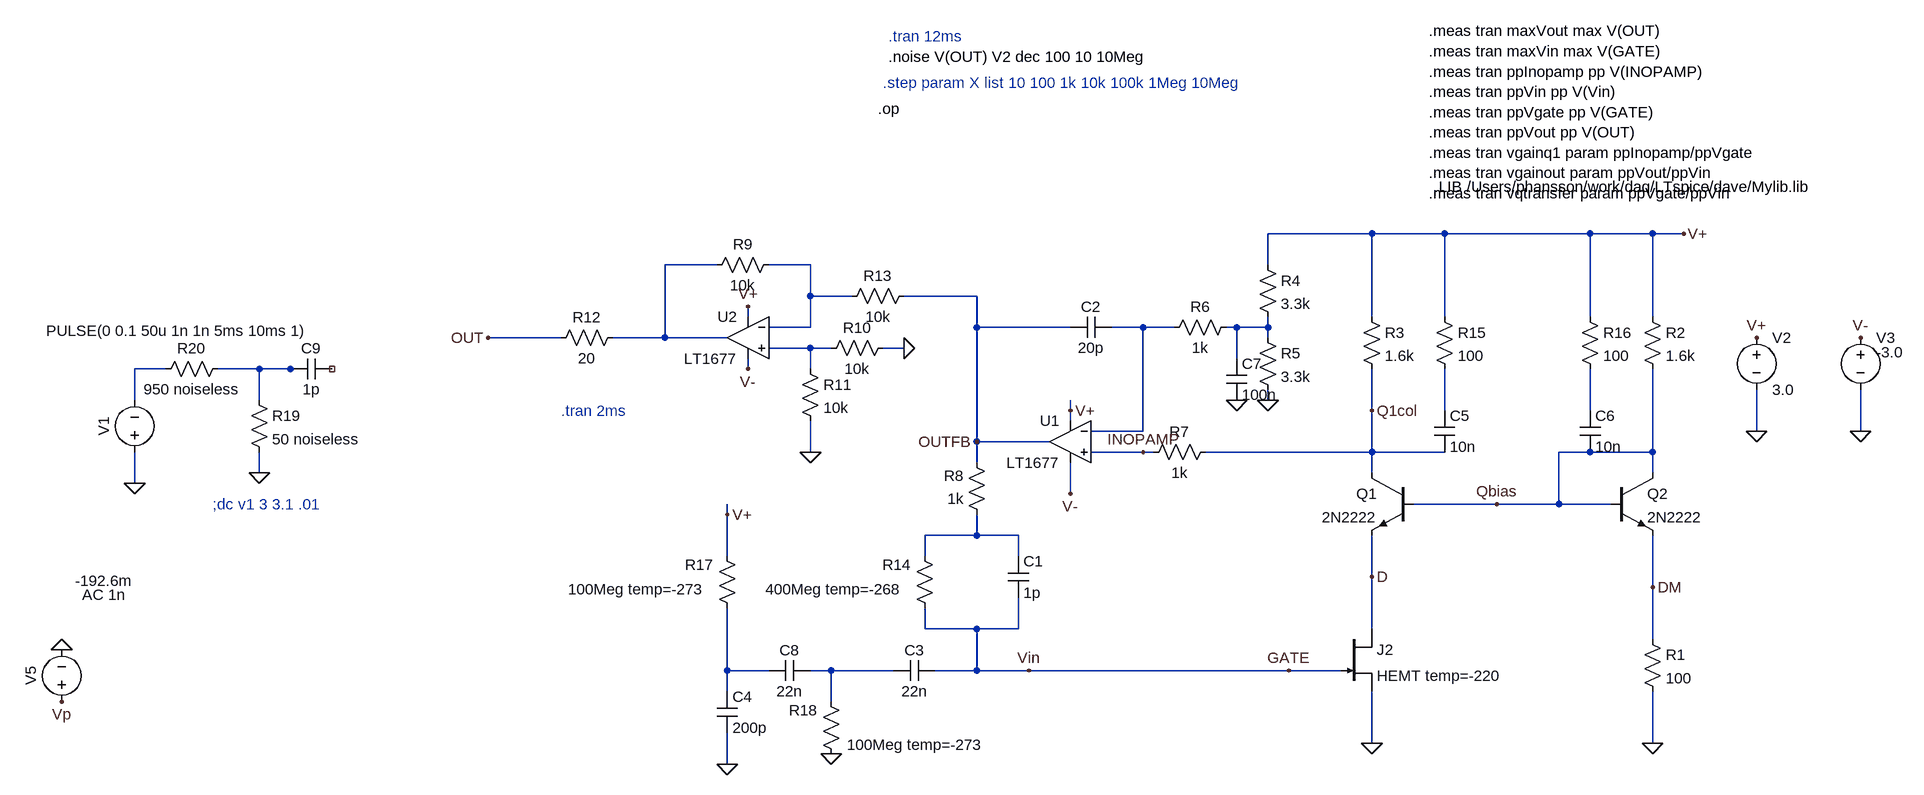
[diagram p0: schematic passive-rst-hemt.asc]
passive-rst-hemt.asc, the LTspice schematic file:
Version 4
SHEET 1 1152 1160
WIRE 224 -96 64 -96
WIRE 336 -96 224 -96
WIRE 560 -96 336 -96
WIRE 656 -96 560 -96
WIRE 704 -96 656 -96
WIRE -784 -48 -864 -48
WIRE -640 -48 -704 -48
WIRE 64 -48 64 -96
WIRE -640 0 -640 -48
WIRE -576 0 -640 0
WIRE -384 0 -496 0
WIRE -736 32 -736 16
WIRE 224 32 224 -96
WIRE 336 32 336 -96
WIRE 560 32 560 -96
WIRE 656 32 656 -96
WIRE -640 48 -640 0
WIRE -640 48 -704 48
WIRE -384 48 -384 0
WIRE -240 48 -384 48
WIRE -128 48 -176 48
WIRE -80 48 -128 48
WIRE 16 48 0 48
WIRE 64 48 64 32
WIRE 64 48 16 48
WIRE -1024 64 -1136 64
WIRE -864 64 -864 -48
WIRE -864 64 -944 64
WIRE -768 64 -864 64
WIRE 64 64 64 48
WIRE -640 80 -704 80
WIRE -608 80 -640 80
WIRE -496 80 -528 80
WIRE 16 96 16 48
WIRE -1632 112 -1680 112
WIRE -1488 112 -1552 112
WIRE -1440 112 -1488 112
WIRE -1424 112 -1440 112
WIRE -736 112 -736 96
WIRE -640 112 -640 80
WIRE -1680 160 -1680 112
WIRE -1488 160 -1488 112
WIRE 64 160 64 144
WIRE -240 176 -240 160
WIRE 224 176 224 112
WIRE 336 176 336 112
WIRE 560 176 560 112
WIRE -240 192 -240 176
WIRE -128 208 -128 48
WIRE -128 208 -208 208
WIRE 816 208 816 144
WIRE 976 208 976 144
WIRE -384 224 -384 48
WIRE -272 224 -384 224
WIRE -640 240 -640 192
WIRE -128 240 -208 240
WIRE -112 240 -128 240
WIRE 224 240 224 176
WIRE 224 240 -32 240
WIRE 336 240 224 240
WIRE 560 240 512 240
WIRE 656 240 656 112
WIRE 656 240 560 240
WIRE -384 256 -384 224
WIRE -1488 272 -1488 240
WIRE 224 272 224 240
WIRE 656 272 656 240
WIRE -1680 288 -1680 240
WIRE -240 304 -240 256
WIRE 416 320 288 320
WIRE 512 320 512 240
WIRE 512 320 416 320
WIRE 592 320 512 320
WIRE -768 336 -768 320
WIRE -384 368 -384 336
WIRE -384 368 -464 368
WIRE -320 368 -384 368
WIRE -768 400 -768 336
WIRE -464 400 -464 368
WIRE -320 400 -320 368
WIRE 224 432 224 368
WIRE 656 448 656 368
WIRE -464 512 -464 480
WIRE -384 512 -464 512
WIRE -320 512 -320 464
WIRE -320 512 -384 512
WIRE 224 512 224 432
WIRE 656 528 656 448
WIRE -768 576 -768 480
WIRE -704 576 -768 576
WIRE -608 576 -640 576
WIRE -512 576 -608 576
WIRE -384 576 -384 512
WIRE -384 576 -448 576
WIRE -304 576 -384 576
WIRE 96 576 -304 576
WIRE 176 576 96 576
WIRE -768 608 -768 576
WIRE -608 624 -608 576
WIRE 224 688 224 608
WIRE 656 688 656 608
WIRE -768 720 -768 672
FLAG 224 688 0
FLAG 816 208 0
FLAG 816 64 V+
FLAG 976 208 0
FLAG 976 64 V-
FLAG 656 688 0
FLAG 224 176 Q1col
FLAG 416 320 Qbias
FLAG 656 448 DM
FLAG 224 432 D
FLAG 64 160 0
FLAG -384 224 OUTFB
FLAG -240 304 V-
FLAG -240 176 V+
FLAG 96 576 GATE
FLAG -736 16 V+
FLAG -736 112 V-
FLAG -496 80 0
FLAG -640 240 0
FLAG -1136 64 OUT
FLAG -128 240 INOPAMP
FLAG 704 -96 V+
FLAG 16 160 0
FLAG -608 704 0
FLAG -1680 288 0
FLAG -1488 272 0
FLAG -768 720 0
FLAG -1792 624 Vp
FLAG -1792 544 0
FLAG -768 336 V+
FLAG -304 576 Vin
SYMBOL voltage 816 48 R0
SYMATTR InstName V2
SYMATTR Value 3.0
SYMBOL njf 176 512 R0
SYMATTR InstName J2
SYMATTR Value HEMT temp=-220
SYMBOL voltage 976 48 R0
WINDOW 3 24 38 Left 2
SYMATTR Value -3.0
SYMATTR InstName V3
SYMBOL npn 592 272 R0
SYMATTR InstName Q2
SYMATTR Value 2N2222
SYMBOL npn 288 272 M0
SYMATTR InstName Q1
SYMATTR Value 2N2222
SYMBOL res 640 512 R0
SYMATTR InstName R1
SYMATTR Value 100
SYMBOL res 640 16 R0
SYMATTR InstName R2
SYMATTR Value 1.6k
SYMBOL res 208 16 R0
SYMATTR InstName R3
SYMATTR Value 1.6k
SYMBOL res 48 -64 R0
SYMATTR InstName R4
SYMATTR Value 3.3k
SYMBOL res 48 48 R0
SYMATTR InstName R5
SYMATTR Value 3.3k
SYMBOL res 16 32 R90
WINDOW 0 0 56 VBottom 2
WINDOW 3 32 56 VTop 2
SYMATTR InstName R6
SYMATTR Value 1k
SYMBOL Opamps/LT1677 -240 160 M0
SYMATTR InstName U1
SYMBOL res -16 224 R90
WINDOW 0 0 56 VBottom 2
WINDOW 3 32 56 VTop 2
SYMATTR InstName R7
SYMATTR Value 1k
SYMBOL Opamps/LT1677 -736 0 M0
SYMATTR InstName U2
SYMBOL res -688 -64 R90
WINDOW 0 0 56 VBottom 2
WINDOW 3 32 56 VTop 2
SYMATTR InstName R9
SYMATTR Value 10k
SYMBOL res -512 64 R90
WINDOW 0 0 56 VBottom 2
WINDOW 3 32 56 VTop 2
SYMATTR InstName R10
SYMATTR Value 10k
SYMBOL res -656 96 R0
SYMATTR InstName R11
SYMATTR Value 10k
SYMBOL res -928 48 R90
WINDOW 0 0 56 VBottom 2
WINDOW 3 32 56 VTop 2
SYMATTR InstName R12
SYMATTR Value 20
SYMBOL res -480 -16 R90
WINDOW 0 0 56 VBottom 2
WINDOW 3 32 56 VTop 2
SYMATTR InstName R13
SYMATTR Value 10k
SYMBOL cap -336 400 R0
SYMATTR InstName C1
SYMATTR Value 1p
SYMBOL res -480 384 R0
WINDOW 0 -49 29 Left 2
WINDOW 3 -229 67 Left 2
SYMATTR InstName R14
SYMATTR Value 400Meg temp=-268
SYMBOL res -368 352 R180
WINDOW 0 36 76 Left 2
WINDOW 3 36 40 Left 2
SYMATTR InstName R8
SYMATTR Value 1k
SYMBOL cap -448 560 R90
WINDOW 0 0 32 VBottom 2
WINDOW 3 32 32 VTop 2
SYMATTR InstName C3
SYMATTR Value 22n
SYMBOL cap -784 608 R0
SYMATTR InstName C4
SYMATTR Value 200p
SYMBOL res 320 16 R0
SYMATTR InstName R15
SYMATTR Value 100
SYMBOL cap 320 176 R0
SYMATTR InstName C5
SYMATTR Value 10n
SYMBOL res 544 16 R0
SYMATTR InstName R16
SYMATTR Value 100
SYMBOL cap 544 176 R0
SYMATTR InstName C6
SYMATTR Value 10n
SYMBOL cap 0 96 R0
SYMATTR InstName C7
SYMATTR Value 100n
SYMBOL res -784 384 R0
WINDOW 0 -49 29 Left 2
WINDOW 3 -229 67 Left 2
SYMATTR InstName R17
SYMATTR Value 100Meg temp=-273
SYMBOL res -624 608 R0
WINDOW 0 -49 29 Left 2
WINDOW 3 40 82 Left 2
SYMATTR InstName R18
SYMATTR Value 100Meg temp=-273
SYMBOL cap -640 560 R90
WINDOW 0 0 32 VBottom 2
WINDOW 3 32 32 VTop 2
SYMATTR InstName C8
SYMATTR Value 22n
SYMBOL voltage -1680 256 R180
WINDOW 0 32 56 VTop 2
WINDOW 3 -65 218 Bottom 2
WINDOW 123 -60 56 VBottom 2
WINDOW 39 0 0 Left 2
SYMATTR InstName V1
SYMATTR Value PULSE(0 0.1 50u 1n 1n 5ms 10ms 1)
SYMBOL cap -1376 96 R90
WINDOW 0 0 32 VBottom 2
WINDOW 3 32 32 VTop 2
SYMATTR InstName C9
SYMATTR Value 1p
SYMBOL res -1504 144 R0
SYMATTR InstName R19
SYMATTR Value 50 noiseless
SYMBOL res -1648 128 R270
WINDOW 0 32 56 VTop 2
WINDOW 3 0 56 VBottom 2
SYMATTR InstName R20
SYMATTR Value 950 noiseless
SYMBOL cap -176 32 R90
WINDOW 0 0 32 VBottom 2
WINDOW 3 32 32 VTop 2
SYMATTR InstName C2
SYMATTR Value 20p
SYMBOL voltage -1792 640 R180
WINDOW 0 32 56 VTop 2
WINDOW 3 -65 218 Bottom 2
WINDOW 123 -65 196 Bottom 2
WINDOW 39 0 0 Left 2
SYMATTR InstName V5
SYMATTR Value -192.6m
SYMATTR Value2 AC 1n
TEXT 320 -168 Left 2 !.LIB /Users/phansson/work/daq/LTspice/dave/Mylib.lib
TEXT -536 -288 Left 2 !.op
TEXT 312 -408 Left 2 !.meas tran maxVout max V(OUT)\n.meas tran maxVin max V(GATE)\n.meas tran ppInopamp pp V(INOPAMP)\n.meas tran ppVin pp V(Vin)\n.meas tran ppVgate pp V(GATE)\n.meas tran ppVout pp V(OUT)\n.meas tran vgainq1 param ppInopamp/ppVgate\n.meas tran vgainout param ppVout/ppVin\n.meas tran vqtransfer param ppVgate/ppVin
TEXT -528 -328 Left 2 ;.step param X list 10 100 1k 10k 100k 1Meg 10Meg
TEXT -520 -400 Left 2 ;.tran 12ms
TEXT -520 -368 Left 2 !.noise V(OUT) V2 dec 100 10 10Meg
TEXT -1560 320 Left 2 ;;dc v1 3 3.1 .01
TEXT -1024 176 Left 2 ;.tran 2ms

The netlist it stands for:
* passive-rst-hemt.asc
V2 V+ 0 3.0
J2 D Vin 0 HEMT temp=-220
V3 V- 0 -3.0
Q2 Qbias Qbias DM 0 2N2222
Q1 Q1col Qbias D 0 2N2222
R1 DM 0 100
R2 V+ Qbias 1.6k
R3 V+ Q1col 1.6k
R4 V+ N004 3.3k
R5 N004 0 3.3k
R6 N004 N003 1k
XU1 INOPAMP N003 V+ V- OUTFB LT1677  ; pins In+ In- V+ V- OUT
R7 Q1col INOPAMP 1k
XU2 N005 N002 V+ V- N001 LT1677  ; pins In+ In- V+ V- OUT
R9 N002 N001 10k
R10 0 N005 10k
R11 N005 0 10k
R12 N001 OUT 20
R13 OUTFB N002 10k
C1 N010 Vin 1p
R14 N010 Vin 400Meg temp=-268
R8 N010 OUTFB 1k
C3 Vin N012 22n
C4 N011 0 200p
R15 V+ N008 100
C5 N008 Q1col 10n
R16 V+ N009 100
C6 N009 Qbias 10n
C7 N004 0 100n
R17 V+ N011 100Meg temp=-273
R18 N012 0 100Meg temp=-273
C8 N012 N011 22n
V1 0 N006 PULSE(0 0.1 50u 1n 1n 5ms 10ms 1)
C9 NC_01 N007 1p
R19 N007 0 50 noiseless
R20 N006 N007 950 noiseless
C2 N003 OUTFB 20p
V5 Vp 0 -192.6m AC 1n
.model NPN NPN
.model PNP PNP
.lib standard.bjt
.model NJF NJF
.model PJF PJF
.lib standard.jft
.LIB /Users/phansson/work/daq/LTspice/dave/Mylib.lib
.op
.meas tran maxVout max V(OUT)
.meas tran maxVin max V(GATE)
.meas tran ppInopamp pp V(INOPAMP)
.meas tran ppVin pp V(Vin)
.meas tran ppVgate pp V(GATE)
.meas tran ppVout pp V(OUT)
.meas tran vgainq1 param ppInopamp/ppVgate
.meas tran vgainout param ppVout/ppVin
.meas tran vqtransfer param ppVgate/ppVin
* .step param X list 10 100 1k 10k 100k 1Meg 10Meg
* .tran 12ms
.noise V(OUT) V2 dec 100 10 10Meg
* ;dc v1 3 3.1 .01
* .tran 2ms
.lib LTC.lib
.backanno
.end